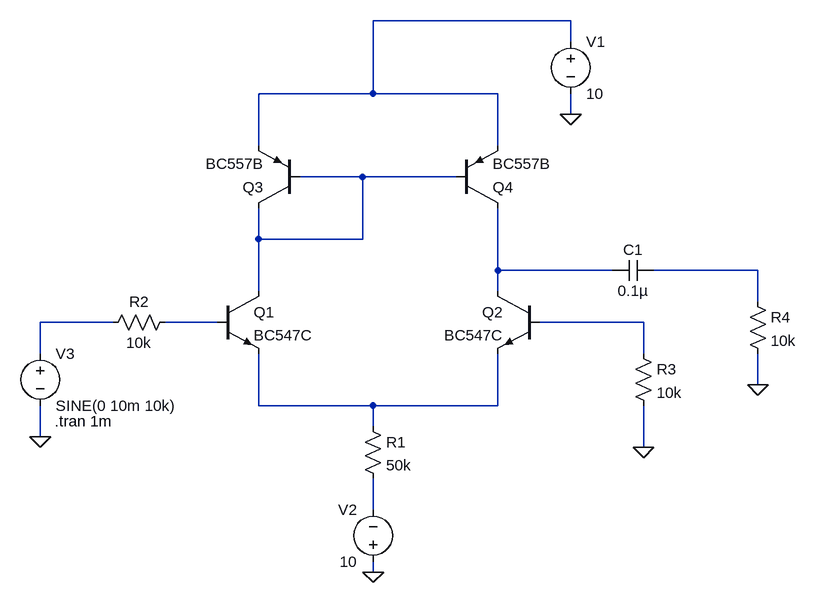
[diagram p0: schematic DIFFERENTIAL AMPLIFIER WITH ACTIVE LOAD.asc]
DIFFERENTIAL AMPLIFIER WITH ACTIVE LOAD.asc, the LTspice schematic file:
Version 4
SHEET 1 1160 680
WIRE 672 -448 368 -448
WIRE 672 -416 672 -448
WIRE 368 -336 368 -448
WIRE 368 -336 192 -336
WIRE 560 -336 368 -336
WIRE 672 -304 672 -336
WIRE 192 -256 192 -336
WIRE 560 -256 560 -336
WIRE 352 -208 256 -208
WIRE 496 -208 352 -208
WIRE 192 -112 192 -160
WIRE 352 -112 352 -208
WIRE 352 -112 192 -112
WIRE 560 -64 560 -160
WIRE 736 -64 560 -64
WIRE 960 -64 800 -64
WIRE 192 -32 192 -112
WIRE 560 -32 560 -64
WIRE 960 -16 960 -64
WIRE -32 16 -144 16
WIRE 128 16 48 16
WIRE 784 16 624 16
WIRE -144 64 -144 16
WIRE 784 64 784 16
WIRE 960 112 960 64
WIRE 192 144 192 64
WIRE 368 144 192 144
WIRE 560 144 560 64
WIRE 560 144 368 144
WIRE 368 176 368 144
WIRE -144 192 -144 144
WIRE 784 208 784 144
WIRE 368 304 368 256
WIRE 368 400 368 384
FLAG 672 -304 0
FLAG 368 400 0
FLAG -144 192 0
FLAG 784 208 0
FLAG 960 112 0
SYMBOL npn 128 -32 R0
SYMATTR InstName Q1
SYMATTR Value BC547C
SYMBOL npn 624 -32 M0
SYMATTR InstName Q2
SYMATTR Value BC547C
SYMBOL pnp 256 -160 R180
SYMATTR InstName Q3
SYMATTR Value BC557B
SYMBOL pnp 496 -160 M180
SYMATTR InstName Q4
SYMATTR Value BC557B
SYMBOL voltage 672 -432 R0
WINDOW 123 0 0 Left 0
WINDOW 39 0 0 Left 0
SYMATTR InstName V1
SYMATTR Value 10
SYMBOL res 352 160 R0
SYMATTR InstName R1
SYMATTR Value 50k
SYMBOL voltage 368 400 R180
WINDOW 0 24 96 Left 2
WINDOW 3 24 16 Left 2
WINDOW 123 0 0 Left 0
WINDOW 39 0 0 Left 0
SYMATTR InstName V2
SYMATTR Value 10
SYMBOL res 64 0 R90
WINDOW 0 0 56 VBottom 2
WINDOW 3 32 56 VTop 2
SYMATTR InstName R2
SYMATTR Value 10k
SYMBOL voltage -144 48 R0
WINDOW 123 0 0 Left 0
WINDOW 39 0 0 Left 0
SYMATTR InstName V3
SYMATTR Value SINE(0 10m 10k)
SYMBOL cap 800 -80 R90
WINDOW 0 0 32 VBottom 2
WINDOW 3 32 32 VTop 2
SYMATTR InstName C1
SYMATTR Value 0.1µ
SYMBOL res 768 48 R0
SYMATTR InstName R3
SYMATTR Value 10k
SYMBOL res 944 -32 R0
SYMATTR InstName R4
SYMATTR Value 10k
TEXT -122 168 Left 2 !.tran 1m

The netlist it stands for:
* DIFFERENTIAL AMPLIFIER WITH ACTIVE LOAD.asc
Q1 N002 N006 N008 0 BC547C
Q2 N003 N007 N008 0 BC547C
Q3 N002 N002 N001 0 BC557B
Q4 N003 N002 N001 0 BC557B
V1 N001 0 10
R1 N008 N009 50k
V2 0 N009 10
R2 N006 N005 10k
V3 N005 0 SINE(0 10m 10k)
C1 N004 N003 0.1µ
R3 N007 0 10k
R4 N004 0 10k
.model NPN NPN
.model PNP PNP
.lib standard.bjt
.tran 1m
.backanno
.end